# Altium schematic sheet MCU.SchDoc
size A; SheetNumber: 2; SheetTotal: 4
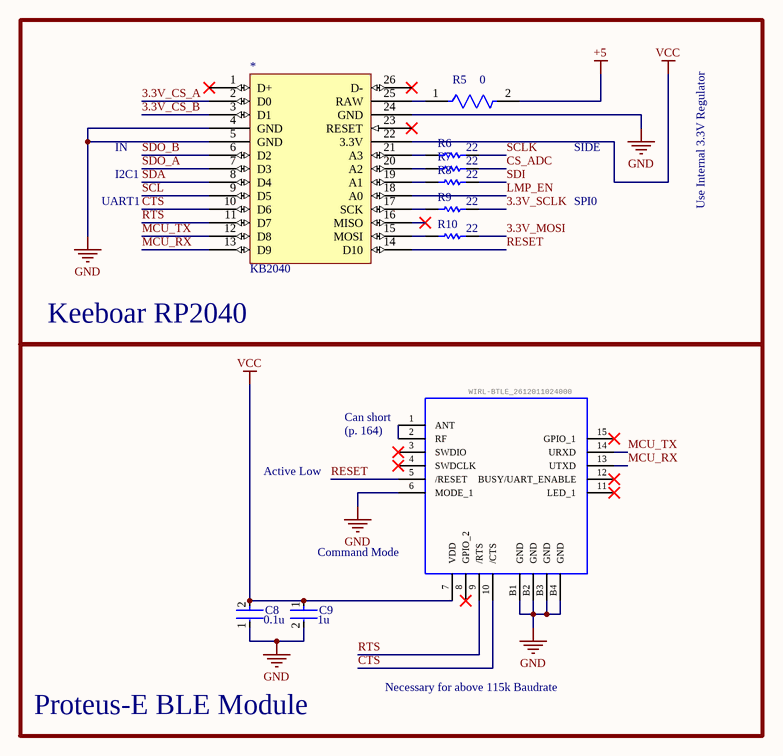
[diagram p0: MCU.SchDoc]

## Parts
*  KB2040  [CAC-254P3300X1775-26N]
?  WIRL-BTLE_2612011024000  [WE-FP-6]
C8  0.1u  [FP-GCJ188-0_2-IPC_C]
C9  1u  [FP-GCM188-0_1-IPC_B]
R5  0  [FP-CRCW0603-MFG]
R6  22  [RESC1608X55X25LL10T15]
R7  22  [RESC1608X55X25LL10T15]
R8  22  [RESC1608X55X25LL10T15]
R9  22  [RESC1608X55X25LL10T15]
R10  22  [RESC1608X55X25LL10T15]

## Blocks framed on the sheet
Keeboar RP2040: * R5-R10
Proteus-E BLE Module: ? C8 C9

## Nets
+5: R5.2
GND: *.4(GND) *.5(GND) *.24(GND) ?.6(MODE_1) ?.B1(GND) ?.B2(GND) ?.B3(GND) ?.B4(GND) C8.1 C9.2
VCC: *.22(3.3V) ?.7(VDD) C8.2 C9.1
3.3V_CS_A: *.2(D0)
3.3V_CS_B: *.3(D1)
3.3V_MOSI: R10.2
3.3V_SCLK: R9.2
CS_ADC: R7.2
CTS: *.10(D6) ?.10(/CTS)
LMP_EN: *.18(A0)
MCU_RX: *.13(D9) ?.13(UTXD)
MCU_TX: *.12(D8) ?.14(URXD)
RESET: *.14(D10) ?.5(/RESET)
RTS: *.11(D7) ?.9(/RTS)
SCL: *.9(D5)
SCLK: R6.2
SDA: *.8(D4)
SDI: R8.2
SDO_A: *.7(D3)
SDO_B: *.6(D2)
Net*_15: *.15(MOSI) R10.1
Net*_17: *.17(SCK) R9.1
Net*_19: *.19(A1) R8.1
Net*_20: *.20(A2) R7.1
Net*_21: *.21(A3) R6.1
Net*_25: *.25(RAW) R5.1
Net?_1: ?.1(ANT) ?.2(RF)

Not connected (* = marked no-connect by the designer): * 1(D+)* 16(MISO)* 23(RESET)* 26(D-)*; ? 3(SWDIO)* 4(SWDCLK)* 8(GPIO_2)* 11(LED_1)* 12(BUSY/UART_ENABLE)* 15(GPIO_1)*

## Notes on the sheet
- IN
- I2C1
- SIDE
- UART1
- SPI0
- Use Internal 3.3V Regulator
- Can short
- (p. 164)
- Active Low
- (near C9) Command Mode
- Necessary for above 115k Baudrate

## Library data of the parts
* = KB2040-3: Adafruit KB2040 - RP2040 Kee Boar Driver; Adafruit Link: https://www.adafruit.com/product/5302#technical-details
? = WIRL-BTLE_2612011024000: Proteus-e Bluetooth® LE 5.1 Module; RX sensitivity e.r.p: -85; Line of Sight: 350m; Frequency: 2402-2480MHz; Output Power e.r.p: -4dBm; Operating Supply Voltage max.: 3.6V; Operating Supply Voltage min.: 1.8V; Part Number: 2612011024000; Published Date: Jan 2022; Publisher: Würth Elektronik; Operating Temperature: -40 to +85degC; Mounting technology: SMT; Packaging: Tape and reel; ComponentLink1Description: Manufacturer; ComponentLink1URL: http://www.we-online.de; ComponentLink2Description: Datasheet; ComponentLink2URL: https://katalog.we-online.de/wco/datasheet/2612011024000.pdf; Supplier 1: Digikey; Supplier Part Number 1: 732-2612011024000CT-ND
C8 = CMP-2006-02223-2: Cap Ceramic 0.1uF 50V X7R 10% Pad SMD 0603 Soft Termination +125°C Automotive T/R; Capacitance: 100nF; Radiation Hardening: No; Dielectric: X7R; Voltage Rating (DC): 50V; Case Code (Imperial): 0603; Length: 1.6mm; Features: Soft Termination; Case Code (Metric): 1608; Case/Package: 0603; Termination: SMD/SMT; Packaging: Tape and Reel; Height: 0.8mm; Tolerance: 10%; Thickness: 0.035inch; Width: 0.031inch; Voltage Rating: 50V; Min Operating Temperature: -55°C; Ratings: AEC-Q200; Package Quantity: 1; Depth: 0.8mm; Mount: Surface Mount; Lead Free: Lead Free; Max Operating Temperature: 125°C
C9 = CMP-2006-02357-2: Ceramic Capacitor for Automotive 1uF  ±10% 16VDC X7R 0603 Paper T/R; Voltage: 16V; Thickness: 0.035inch; Width: 0.031inch; Radiation Hardening: No; Depth: 0.8mm; Max Operating Temperature: 125°C; Package Quantity: 1; Ratings: AEC-Q200; Min Operating Temperature: -55°C; Packaging: Tape and Reel; Case Code (Metric): 1608; REACH SVHC: No SVHC; Dielectric: X7R; Case Code (Imperial): 0603; Length: 1.6mm; Height: 0.8mm; Voltage Rating: 16V; Termination: SMD/SMT; Case/Package: 0603; Voltage Rating (DC): 16V; Tolerance: 10%; Capacitance: 1uF; Mount: Surface Mount; Lead Free: Lead Free
R5 = CMP-02407-011577-1: RES SMD 0 OHM JUMPER 1/10W 0603; Resistance: 0R; Tolerance: 5%; Power Dissipation: 100mW; Voltage Rating (DC): 75V; Temperature Coefficient: 100ppm/°C; Min Operating Temperature: -55°C; RoHS Compliant: No; Military Standard: Not; Case Code (Imperial): 0603; Series: CRCW; Resistor Type: Thick Film; Features: Automotive AEC-Q200; Power Rating: 100mW; Radiation Hardening: No; Case/Package: 0603; Width: 0.033inch; Length: 1.55mm; Case Code (Metric): 1608; Depth: 0.85mm; Package Quantity: 5000; Size Code: 0603; Weight: 7.1E-05oz; Termination: SMD/SMT; Lead Free: Contains Lead; Packaging: Tape and Reel; Contact Plating: Tin; Max Operating Temperature: 155°C; Number of Terminations: 2; Max Power Dissipation: 100mW; Construction: Rectangular; Mount: Surface Mount; Height: 0.02inch; Voltage Rating: 75V
R6-R10 = CMP-2000-04180-1: Manufacturer: Yageo; Part Number: RC0603FR-1022RL